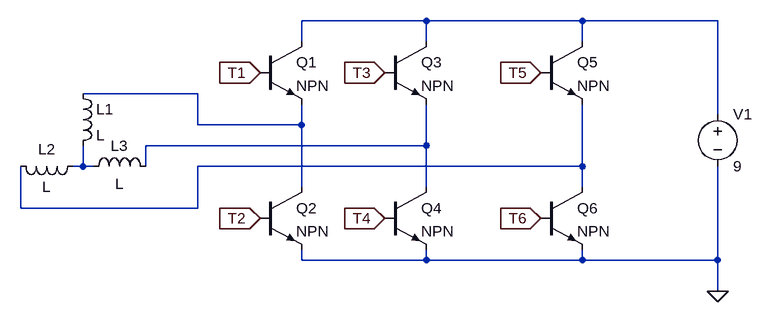
[diagram p0: schematic Sim1.asc]
Sim1.asc, the LTspice schematic file:
Version 4.1
SHEET 1 880 680
WIRE 160 -64 -32 -64
WIRE 400 -64 160 -64
WIRE 608 -64 400 -64
WIRE -32 -32 -32 -64
WIRE 160 -32 160 -64
WIRE 400 -32 400 -64
WIRE -192 48 -368 48
WIRE 608 80 608 -64
WIRE -192 96 -192 48
WIRE -32 96 -32 64
WIRE -32 96 -192 96
WIRE 160 128 160 64
WIRE 160 128 -272 128
WIRE -368 160 -368 128
WIRE -368 160 -384 160
WIRE -352 160 -368 160
WIRE -272 160 -272 128
WIRE 400 160 400 64
WIRE 400 160 -192 160
WIRE -32 192 -32 96
WIRE 160 192 160 128
WIRE 400 192 400 160
WIRE -464 224 -464 160
WIRE -192 224 -192 160
WIRE -192 224 -464 224
WIRE -32 304 -32 288
WIRE 160 304 160 288
WIRE 160 304 -32 304
WIRE 400 304 400 288
WIRE 400 304 160 304
WIRE 608 304 608 160
WIRE 608 304 400 304
WIRE 608 352 608 304
FLAG 608 352 0
FLAG -96 16 T1
IOPIN -96 16 In
FLAG -96 240 T2
IOPIN -96 240 In
FLAG 96 240 T4
IOPIN 96 240 In
FLAG 96 16 T3
IOPIN 96 16 In
FLAG 336 16 T5
IOPIN 336 16 In
FLAG 336 240 T6
IOPIN 336 240 In
SYMBOL voltage 608 64 R0
WINDOW 123 0 0 Left 0
WINDOW 39 0 0 Left 0
SYMATTR InstName V1
SYMATTR Value 9
SYMBOL npn -96 -32 R0
SYMATTR InstName Q1
SYMBOL npn -96 192 R0
SYMATTR InstName Q2
SYMBOL npn 96 -32 R0
SYMATTR InstName Q3
SYMBOL npn 96 192 R0
SYMATTR InstName Q4
SYMBOL npn 336 -32 R0
SYMATTR InstName Q5
SYMBOL npn 336 192 R0
SYMATTR InstName Q6
SYMBOL ind -384 32 R0
SYMATTR InstName L1
SYMBOL ind -368 144 R90
WINDOW 0 5 56 VBottom 2
WINDOW 3 32 56 VTop 2
SYMATTR InstName L2
SYMBOL ind -368 176 R270
WINDOW 0 32 56 VTop 2
WINDOW 3 5 56 VBottom 2
SYMATTR InstName L3

The netlist it stands for:
* Sim1.asc
V1 N001 0 9
Q1 N001 T1 N002 0 NPN
Q2 N002 T2 0 0 NPN
Q3 N001 T3 N003 0 NPN
Q4 N003 T4 0 0 NPN
Q5 N001 T5 N005 0 NPN
Q6 N005 T6 0 0 NPN
L1 N002 N004 L
L2 N004 N005 L
L3 N004 N003 L
.model NPN NPN
.model PNP PNP
.lib standard.bjt
.backanno
.end